# EAGLE design power (EAGLE 6.1)
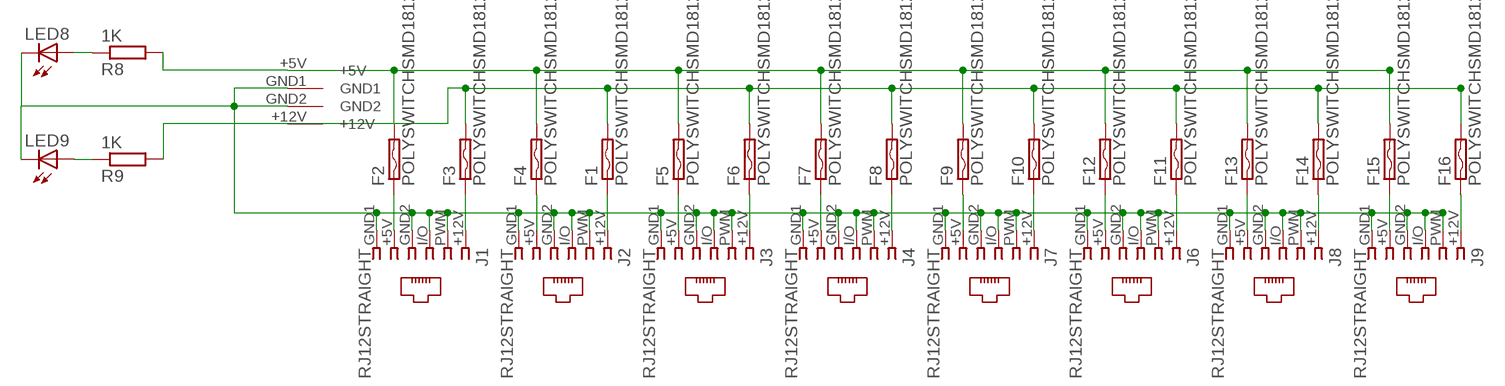
[diagram p0: schematic, sheet 1]

## Parts
F1  POLYSWITCHSMD1812  [C1812]
F2  POLYSWITCHSMD1812  [C1812]
F3  POLYSWITCHSMD1812  [C1812]
F4  POLYSWITCHSMD1812  [C1812]
F5  POLYSWITCHSMD1812  [C1812]
F6  POLYSWITCHSMD1812  [C1812]
F7  POLYSWITCHSMD1812  [C1812]
F8  POLYSWITCHSMD1812  [C1812]
F9  POLYSWITCHSMD1812  [C1812]
F10  POLYSWITCHSMD1812  [C1812]
F11  POLYSWITCHSMD1812  [C1812]
F12  POLYSWITCHSMD1812  [C1812]
F13  POLYSWITCHSMD1812  [C1812]
F14  POLYSWITCHSMD1812  [C1812]
F15  POLYSWITCHSMD1812  [C1812]
F16  POLYSWITCHSMD1812  [C1812]
J1  RJ12STRAIGHT  [RJ12-STRAIGHT]
J2  RJ12STRAIGHT  [RJ12-STRAIGHT]
J3  RJ12STRAIGHT  [RJ12-STRAIGHT]
J4  RJ12STRAIGHT  [RJ12-STRAIGHT]
J6  RJ12STRAIGHT  [RJ12-STRAIGHT]
J7  RJ12STRAIGHT  [RJ12-STRAIGHT]
J8  RJ12STRAIGHT  [RJ12-STRAIGHT]
J9  RJ12STRAIGHT  [RJ12-STRAIGHT]
LED8  LED3MM  [LED3MM]
LED9  LED3MM  [LED3MM]
R8  1K  R-EU_M1206  [M1206]
R9  1K  R-EU_M1206  [M1206]
U$1  KPJX-4S-S  [KPJX-4S-S]

## Nets
GND [highpower]: J1.GND1 J1.GND2 J1.I/O J1.PWM J2.GND1 J2.GND2 J2.I/O J2.PWM J3.GND1 J3.GND2 J3.I/O J3.PWM J4.GND1 J4.GND2 J4.I/O J4.PWM J6.GND1 J6.GND2 J6.I/O J6.PWM J7.GND1 J7.GND2 J7.I/O J7.PWM J8.GND1 J8.GND2 J8.I/O J8.PWM J9.GND1 J9.GND2 J9.I/O J9.PWM LED8.K(C) LED9.K(C) U$1.GND1 U$1.GND2
N$1: F2.1 J1.+5V
N$2: F3.1 J1.+12V
N$3: F4.1 J2.+5V
N$4: F1.1 J2.+12V
N$5: F5.1 J3.+5V
N$6: F6.1 J3.+12V
N$7: F7.1 J4.+5V
N$8: F9.1 J7.+5V
N$9: F8.1 J4.+12V
N$10: F10.1 J7.+12V
N$11: F11.1 J6.+12V
N$12: F12.1 J6.+5V
N$13: F13.1 J8.+5V
N$14: F14.1 J8.+12V
N$15: F15.1 J9.+5V
N$16: F16.1 J9.+12V
N$17: F2.2 F4.2 F5.2 F7.2 F9.2 F12.2 F13.2 F15.2 R8.2 U$1.+5V
N$18: F1.2 F3.2 F6.2 F8.2 F10.2 F11.2 F14.2 F16.2 R9.2 U$1.+12V
N$20: LED9.A R9.1
N$23: LED8.A R8.1

## Library data of the parts
F1-F16 = lpatiny:POLYSWITCH: PolySwitch (TM) Resettable Device Source: Data sheet <http://www.farnell.com/datasheets/13482.pdf>
J1-J4 J6-J9 = lpatiny:RJ12: CORCOM Modular RJ Jacks No Shield Source: www.tycoelectronics.com .. ENG_DS_1654001_1099_RJ_L_0507.pdf
LED8 LED9 = lpatiny:LED3MM
R8 R9 = resistor:R-EU_: RESISTOR, European symbol
U$1 = lpatiny:KPJX-4S-S

## Net classes
0 default: width 0.457 mm
2 highpower: width 1.372 mm

## Board
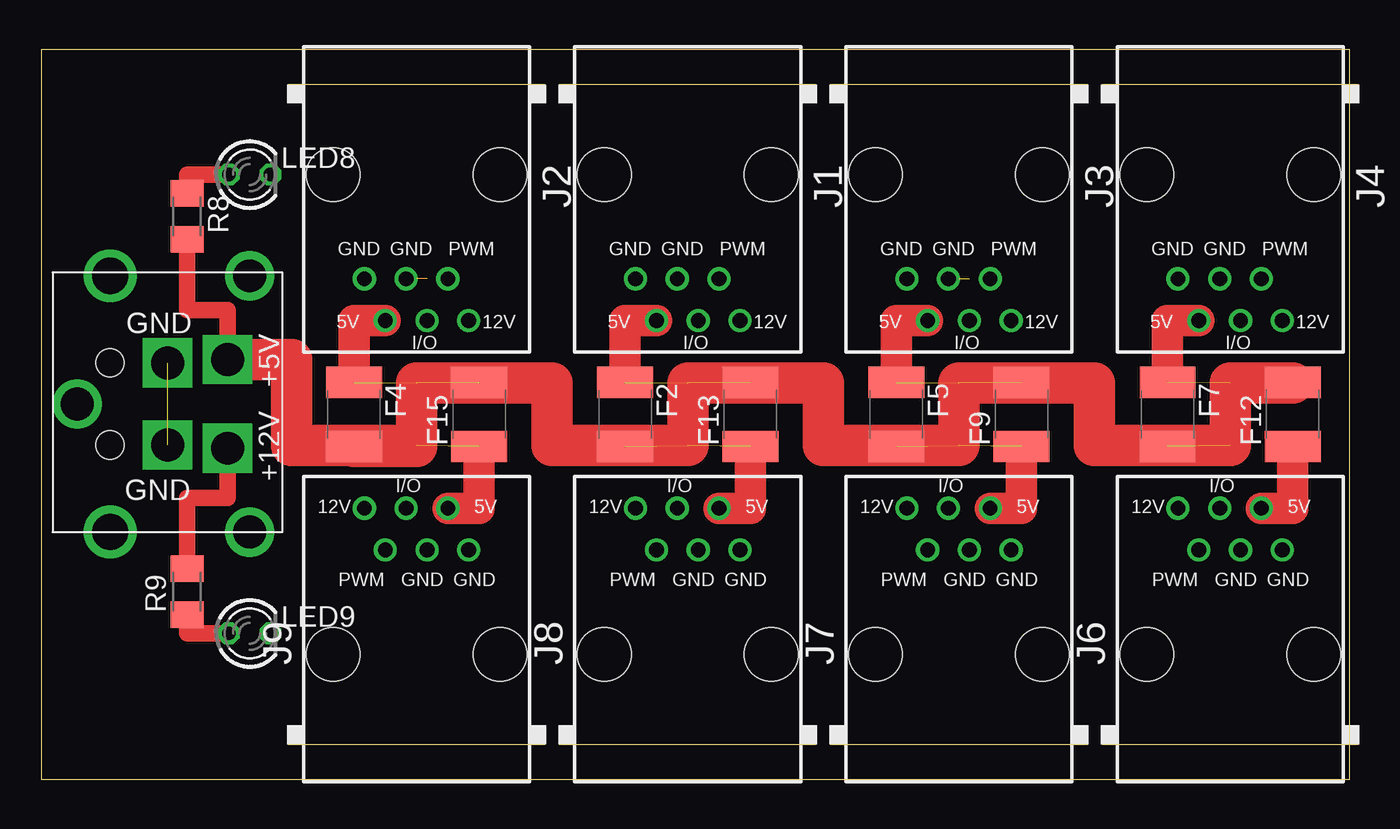
[diagram p1: board, top side]
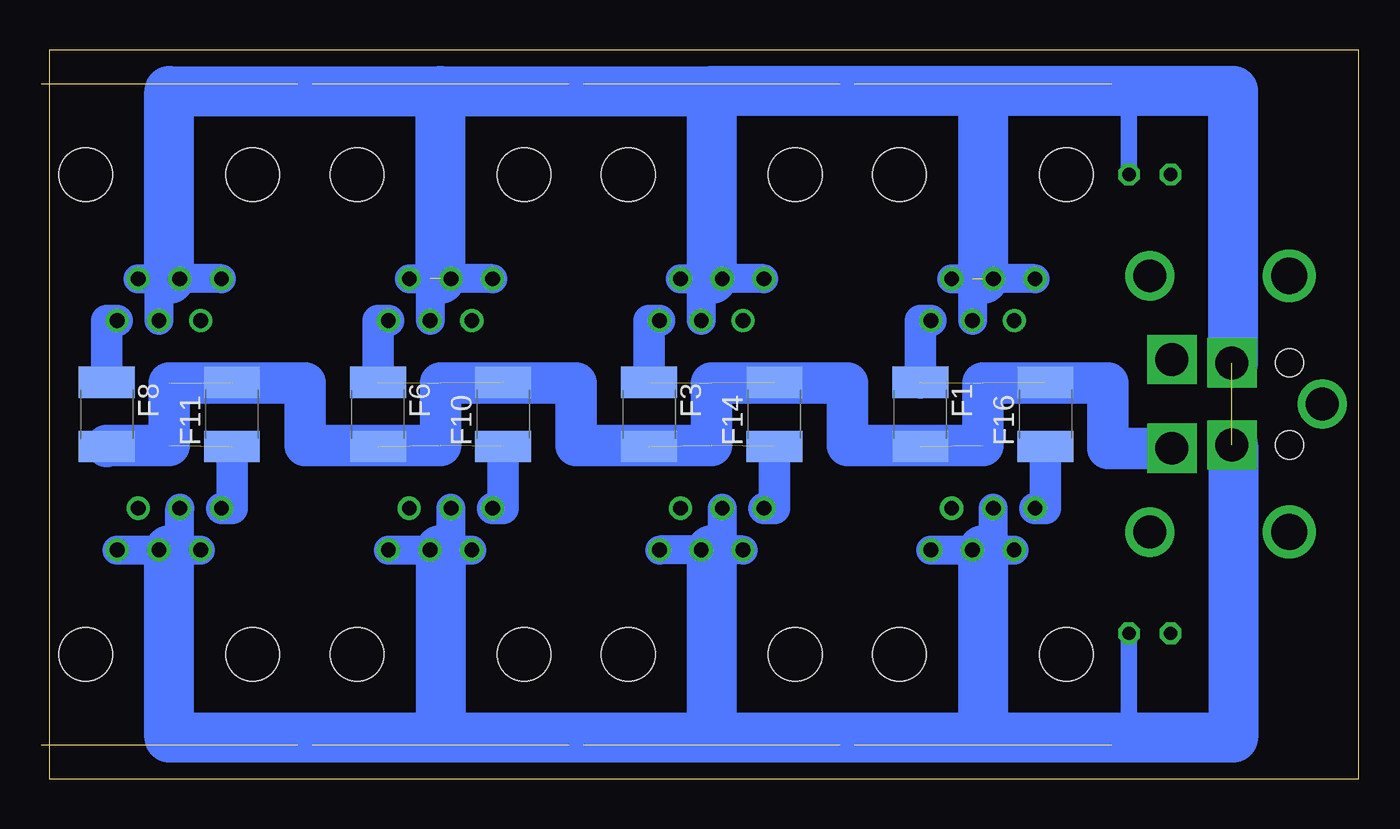
[diagram p2: board, bottom side, seen from below]

Size 79.68 x 44.44 mm. Coordinates in mm from the lower left corner, seen from the top.
Outline: 0,0 79.68,0 79.68,44.44 0,44.44 0,0
Copper layers (1*16): Top 0.035mm / dielectric 1.5mm / Bottom 0.035mm
Design rules: minimum track width 10mil, minimum drill 24mil, track to track 8mil, track to pad 8mil, pad to pad 8mil, via to via 8mil, smd to smd 8mil, copper to edge 40mil, drill to drill 8mil, minimum pad ring 10mil, minimum via ring 8mil, stop-mask expansion 4mil, vias tented up to drill 0mil, thermal gap 10mil

### Footprints (pad centres in the part's own frame; a part is rotated, then mirrored left to right if it is on the bottom)
C1812 = smd 1.9 x 3.4: 1 -1.95,0; 2 1.95,0
RJ12-STRAIGHT = drill 0.9 pad 1.4: +5V 1.905,8.89; +12V -3.175,8.89; GND1 3.175,6.35; GND2 0.635,6.35; I/O -0.635,8.89; PWM -1.905,6.35 | hole 3.251: -5.08,0; 5.08,0
LED3MM = drill 0.813 octagon: A -1.27,0; K 1.27,0
M1206 = smd 1.6 x 2: 1 -1.4,0; 2 1.4,0
KPJX-4S-S = drill 2 square: +5V 2.7,1.35; +12V -2.7,1.35; GND1 -2.5,5; GND2 2.5,5 | drill 2: P$1 -7.8,0; P$2 7.8,0; P$11 0,10.5 | drill 2.2: P$3 -7.8,8.5; P$4 7.8,8.5 | hole 1.7: -2.5,8.5; 2.5,8.5

### Placement (x,y rotation side)
F1  26.67,22.23 270 bottom
F2  35.56,22.23 270 top
F3  43.18,22.23 270 bottom
F4  19.05,22.23 270 top
F5  52.07,22.23 270 top
F6  59.69,22.23 270 bottom
F7  68.58,22.23 270 top
F8  76.2,22.23 270 bottom
F9  59.69,22.23 90 top
F10  52.07,22.23 90 bottom
F11  68.58,22.23 90 bottom
F12  76.2,22.23 90 top
F13  43.18,22.23 90 top
F14  35.56,22.23 90 bottom
F15  26.67,22.23 90 top
F16  19.05,22.23 90 bottom
J1  39.37,36.83 180 top
J2  22.86,36.83 180 top
J3  55.88,36.83 180 top
J4  72.39,36.83 180 top
J6  72.39,7.62 0 top
J7  55.88,7.62 0 top
J8  39.37,7.62 0 top
J9  22.86,7.62 0 top
LED8  12.7,36.83 0 top
LED9  12.7,8.89 0 top
R8  8.89,34.29 270 top
R9  8.89,11.43 90 top
U$1  12.7,22.86 90 top

### Tracks (layer width: path | path; a pad name or v marks a point on that pad's centre or on a via)
GND  (3 unrouted)
  Bottom 1.016: LED8.K 13.97,41.91 | LED9.K 13.97,2.54
  Bottom 1.778: J9.GND1 J9.GND2 22.86,13.97 22.23,13.97 | 22.23,13.97 J9.PWM | 22.23,13.97 J9.I/O | J8.PWM 38.73,13.97 | 38.73,13.97 39.37,13.97 J8.GND2 J8.GND1 | J8.I/O 38.73,13.97 | J7.GND1 J7.GND2 55.88,13.97 55.24,13.97 | 55.24,13.97 J7.PWM | 55.24,13.97 J7.I/O | J6.GND1 J6.GND2 72.39,13.97 71.75,13.97 | 71.75,13.97 J6.I/O | 71.75,13.97 J6.PWM | J2.GND1 J2.GND2 23.5,30.48 J2.I/O | J2.PWM 22.86,30.48 | J1.GND1 J1.GND2 39.37,30.48 40.01,30.48 | J1.I/O 40.01,30.48 | J1.PWM 40.01,30.48 | J3.GND1 J3.GND2 | J3.GND2 56.52,30.48 J3.I/O | J3.PWM J3.GND2 | J4.GND1 J4.GND2 72.39,30.48 73.03,30.48 | J4.PWM 73.03,30.48 | 73.03,30.48 J4.I/O
  Bottom 3.048: 22.86,41.91 39.37,41.91 | 72.39,30.48 72.39,41.91 55.88,41.91 | 55.88,30.48 55.88,41.91 | 55.88,41.91 39.37,41.91 | 39.37,41.91 39.37,30.48 | U$1.GND2 7.62,25.36 7.62,41.91 13.97,41.91 22.86,41.91 | 22.86,41.91 22.86,30.48 | U$1.GND1 7.62,20.36 7.62,2.54 13.97,2.54 22.86,2.54 | 22.86,13.97 22.86,2.54 | 22.86,2.54 39.37,2.54 | 39.37,13.97 39.37,2.54 | 39.37,2.54 55.88,2.54 | 55.88,13.97 55.88,2.54 | 55.88,2.54 72.39,2.54 72.39,13.97
N$1
  Top 1.93: J1.+5V 35.56,27.94 F2.1
N$2
  Bottom 1.93: J1.+12V 43.18,27.94 F3.1
N$3
  Top 1.93: J2.+5V 19.05,27.94 F4.1
N$4  (1 unrouted)
  Bottom 1.93: J2.+12V 26.67,27.94 26.67,24.13
N$5
  Top 1.93: J3.+5V 52.07,27.94 F5.1
N$6
  Bottom 1.93: J3.+12V 59.69,27.94 F6.1
N$7
  Top 1.93: J4.+5V 68.58,27.94 F7.1
N$8
  Top 1.93: J7.+5V 59.69,16.51 F9.1
N$9
  Bottom 1.93: J4.+12V 76.2,27.94 F8.1
N$10
  Bottom 1.93: J7.+12V 52.07,16.51 F10.1
N$11
  Bottom 1.93: J6.+12V 68.58,16.51 F11.1
N$12
  Top 1.93: J6.+5V 76.2,16.51 F12.1
N$13
  Top 1.93: J8.+5V 43.18,16.51 F13.1
N$14
  Bottom 1.93: J8.+12V 35.56,16.51 F14.1
N$15
  Top 1.93: J9.+5V 26.67,16.51 F15.1
N$16
  Bottom 1.93: J9.+12V 19.05,16.51 F16.1
N$17  (6 unrouted)
  Top 1.016: R8.2 8.89,28.57 11.35,28.57 U$1.+5V
  Top 1.93: F12.2 72.39,24.18 72.39,20.32
  Top 2.54: U$1.+5V 15.24,25.56 15.24,20.32 22.86,20.32 | F4.2 22.86,20.27 22.86,20.32 | 22.86,20.32 22.86,24.13 31.11,24.13 31.11,20.32 39.37,20.32 39.37,24.13 47.62,24.13 47.62,20.32 55.88,20.32 55.88,24.13 64.14,24.13 64.14,20.32 72.39,20.32 72.39,24.13 76.2,24.13
N$18  (7 unrouted)
  Top 1.016: R9.2 8.89,17.14 11.35,17.14 U$1.+12V
  Bottom 2.54: U$1.+12V 15.24,20.16 15.24,24.13 22.86,24.13 22.86,20.32 31.11,20.32 31.11,24.13 39.37,24.13 39.37,20.32 47.62,20.32 47.62,24.13 55.88,24.13 55.88,20.32 64.14,20.32 64.14,24.13 72.39,24.13 72.39,20.32 76.2,20.32 F8.2
N$20
  Top 1.016: LED9.A 8.89,8.89 R9.1
N$23
  Top 1.016: LED8.A 8.89,36.83 R8.1